# Altium schematic sheet 2_wiring drawing.SchDoc: POWER & IGON
size A2; ApprovedBy: Approved By; CheckedBy: Sky Ma; DrawnBy: Jack; Address1: 1; Address2: 2; Address3: 3; Address4: 4; DocumentNumber: 04-TE-42-4015-0PA-A; Revision: B; SheetNumber: 3; SheetTotal: 6; SheetSize: A2; CheckedByDate: 2022-11-19; DrawByDate: 2022-11-19; SiteName: EMS TD Huangpu; : Record=PageOptions|CenterHorizontal=True|CenterVertical=True|PrintScale=0.73|XCorrection=1.00|YCorrection=1.00|PrintKind=0|BorderSize=5000000|LeftOffset=0|BottomOffset=0|Orientation=2|PaperLength=1000|PaperWidth=1000|Scale=100|PaperSource=15|PrintQuality=1200|MediaType=1|DitherType=10|PaperKind=A3|Pr; PageSetup: Record=PageOptions|CenterHorizontal=True|CenterVertical=True|PrintScale=0.52|XCorrection=1.00|YCorrection=1.00|PrintKind=0|BorderSize=5000000|LeftOffset=0|BottomOffset=0|Orientation=2|PaperLength=1000|PaperWidth=1000|Scale=100|PaperSource=15|PrintQuality=1200|MediaType=1|DitherType=10|PaperKind=A4|PrintScaleMode=1; ProjectName: 19205_BMW CCU DDR PCBA FT fixture wiring
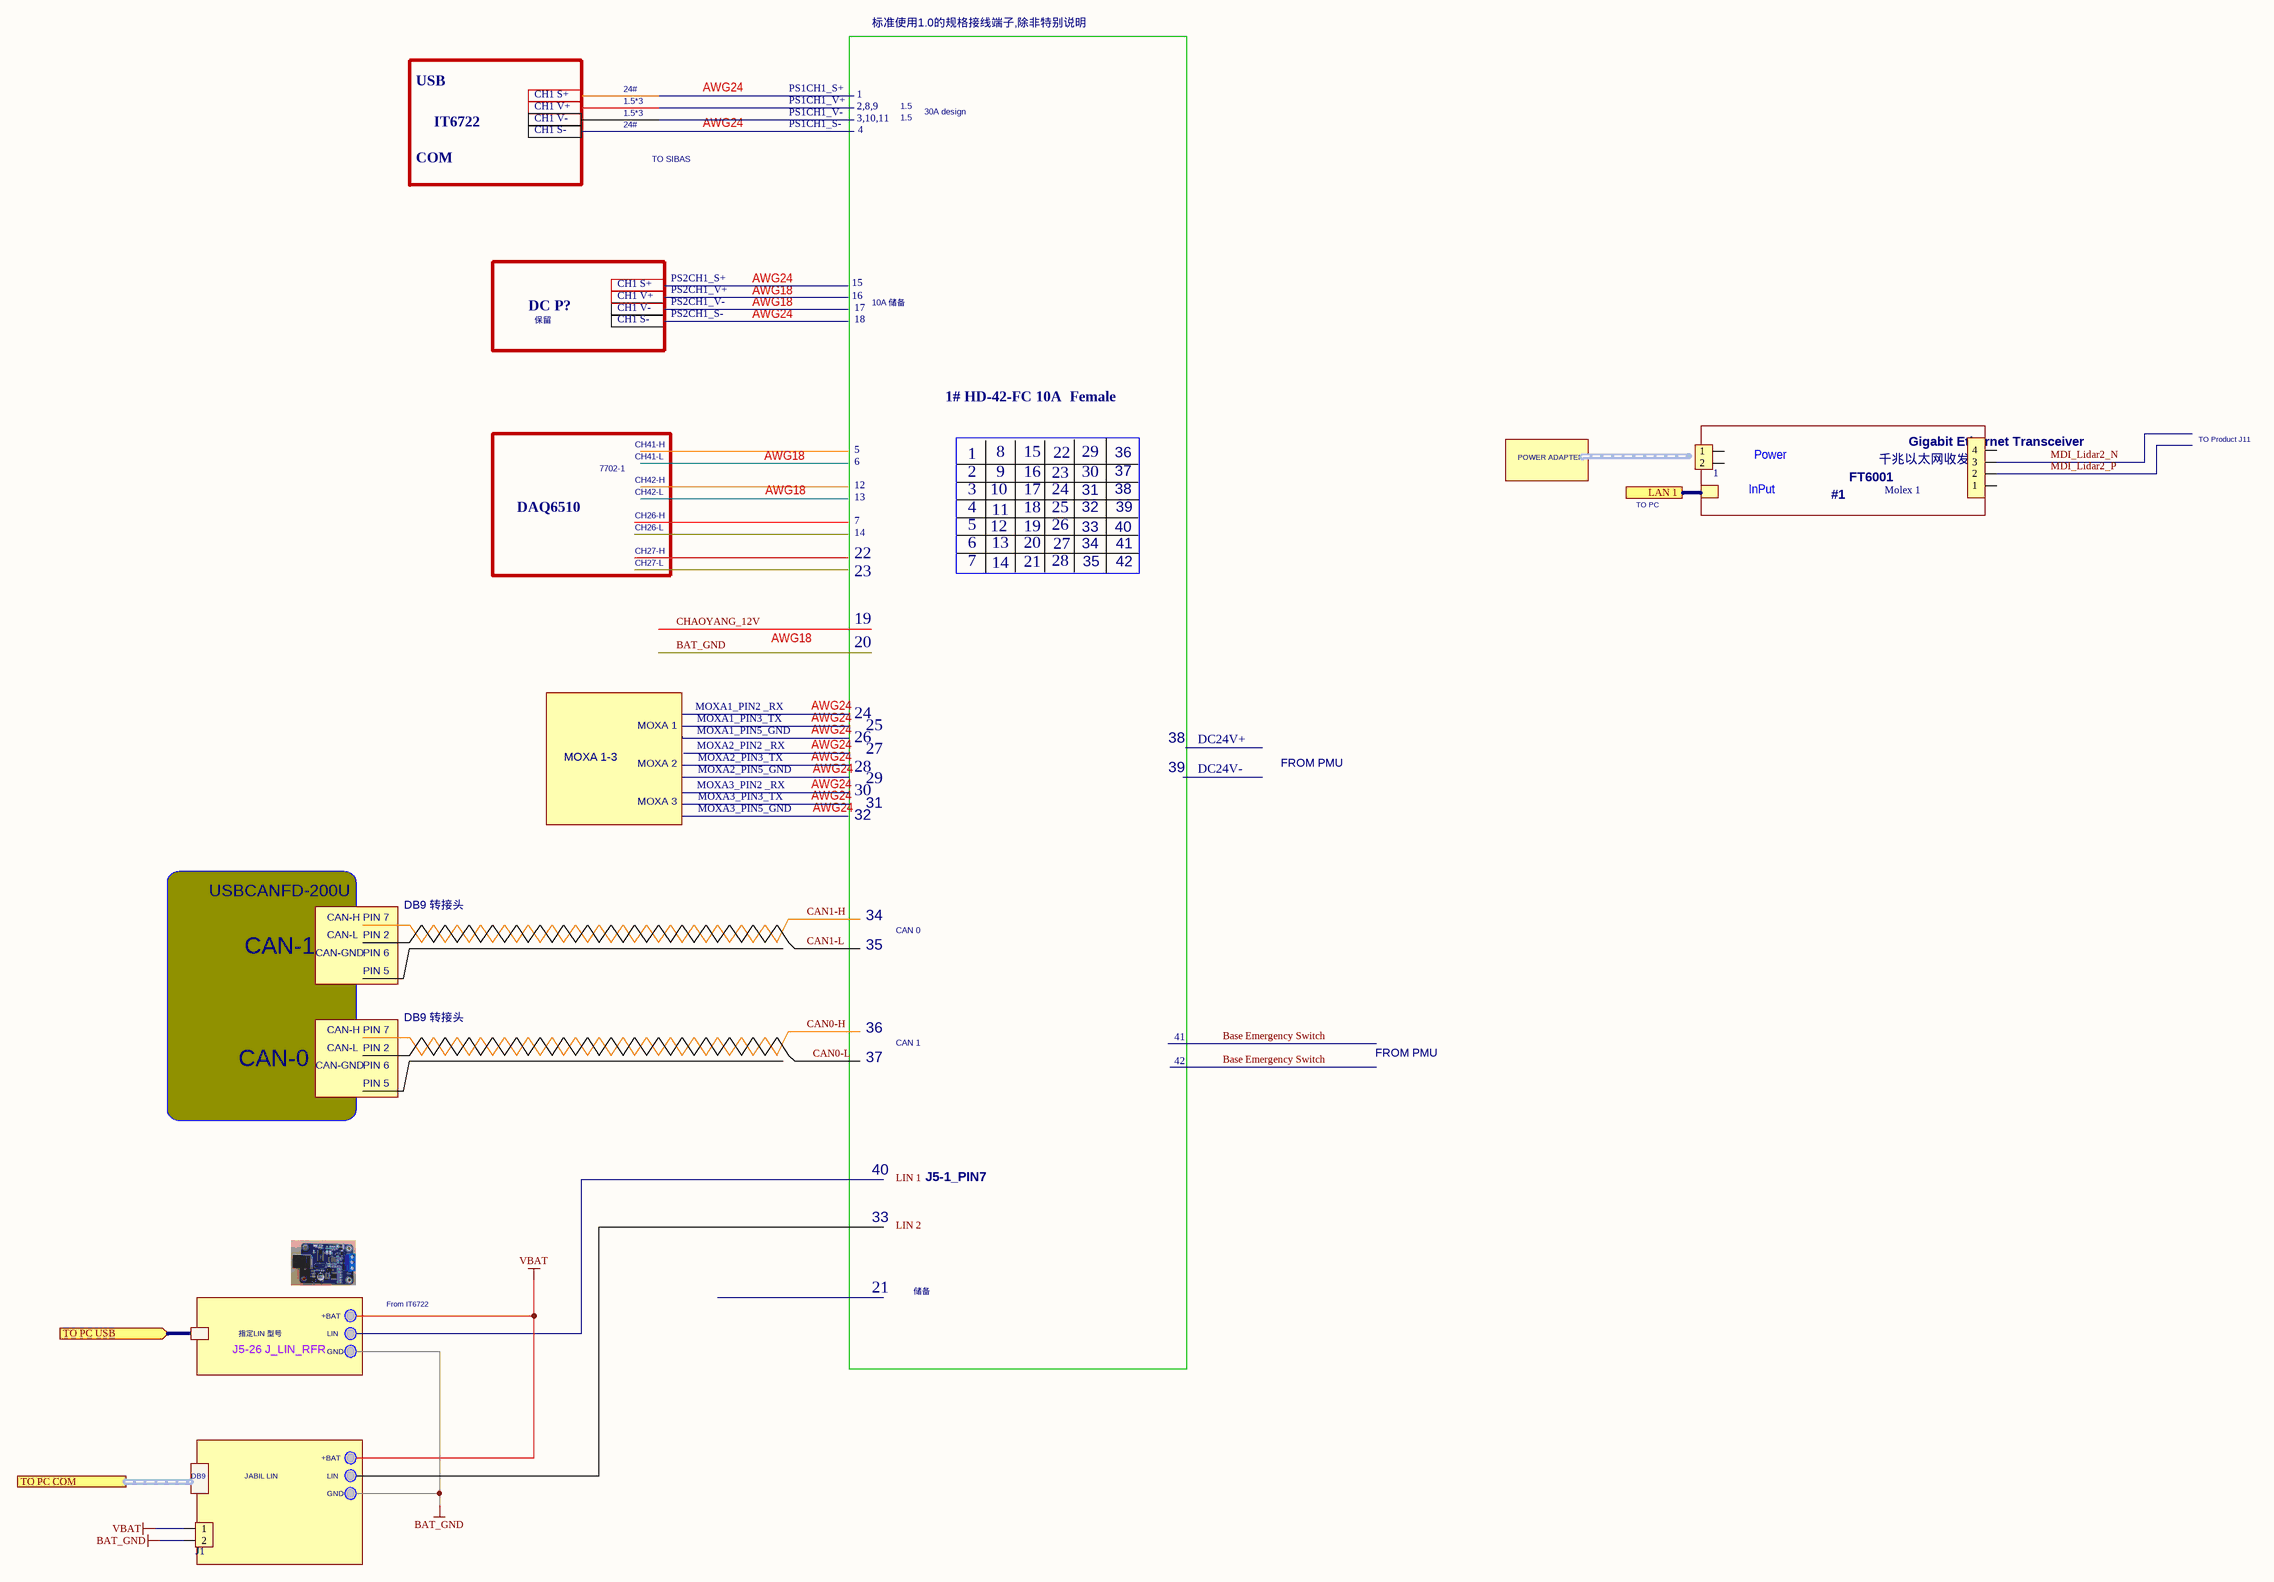
[diagram p0: 2_wiring drawing.SchDoc]

## Parts
1  2.54 connector  [2.54mm-2]  (value not drawn)
J1  5.08mm conncetor  [5.08mm-2-Bend]  (value not drawn)
Molex_1  2.54 connector  [2.54mm-4]  (value not drawn)

## Ports
LAN 1 (in), TO PC COM, TO PC USB (in)

## Nets
BAT_GND: J1.2
VBAT: J1.1
MDI_Lidar2_N: Molex_1.3
MDI_Lidar2_P: Molex_1.2

Not connected (* = marked no-connect by the designer): 1 1 2; Molex_1 1 4

## Notes on the sheet
- 标准使用1.0的规格接线端子,除非特别说明
- USB
- 1.5*3
- 24#
- AWG24
- 1
- 2,8,9
- 3,10,11
- 1.5
- 30A design
- COM
- IT6722
- TO SIBAS
- 4
- AWG18
- 15
- DC P?
- 保留
- 16
- 17
- 18
- 10A 储备
- 1# HD-42-FC 10A  Female
- 7702-1
- CH41-H
- CH41-L
- 6
- 5
- 8
- 22
- 29
- 36
- 37
- POWER ADAPTER
- (near 1) Power
- 千兆以太网收发器
- (near 1) Gigabit Ethernet Transceiver
- TO Product J11
- DAQ6510
- CH42-L
- CH42-H
- CH26-H
- CH26-L
- 12
- 13
- 7
- 2
- 3
- 10
- 11
- 9
- 19
- 23
- 24
- 25
- 26
- 30
- 31
- 32
- 33
- 38
- 40
- 39
- TO PC
- (near 1) InPut
- #1
- FT6001
- CH27-H
- CH27-L
- 14
- 20
- 21
- 28
- 27
- 34
- 35
- 42
- 41
- MOXA 1-3
- MOXA 1
- MOXA 2
- DC24V+
- FROM PMU
- MOXA 3
- DC24V-
- USBCANFD-200U
- CAN-H
- CAN-L
- PIN 2
- PIN 7
- DB9 转接头
- CAN 0
- CAN-1
- CAN-GND
- PIN 6
- PIN 5
- CAN-0
- CAN 1
- J5-1_PIN7
- From IT6722
- 储备
- 指定LIN 型号
- +BAT
- LIN
- GND
- DB9
- JABIL LIN
- Labels drawn without touching a wire or pin: CAN0-H, CAN0-L, CAN1-H, CAN1-L, CH1 S+, CH1 S-, CH1 V+, CH1 V-, J5-26 J_LIN_RFR, LIN 1, LIN 2
- Document Number:
- Rev:
- Project Name:
- Drawn By:
- Date:
- Titile:
- Checked By:
- Sheet:
- Of

## Library data of the parts
1 = CON2-2.54
J1 = CON2-5.08
Molex_1 = CON4-2.54